# Altium schematic sheet Sheet1.SchDoc
size Letter
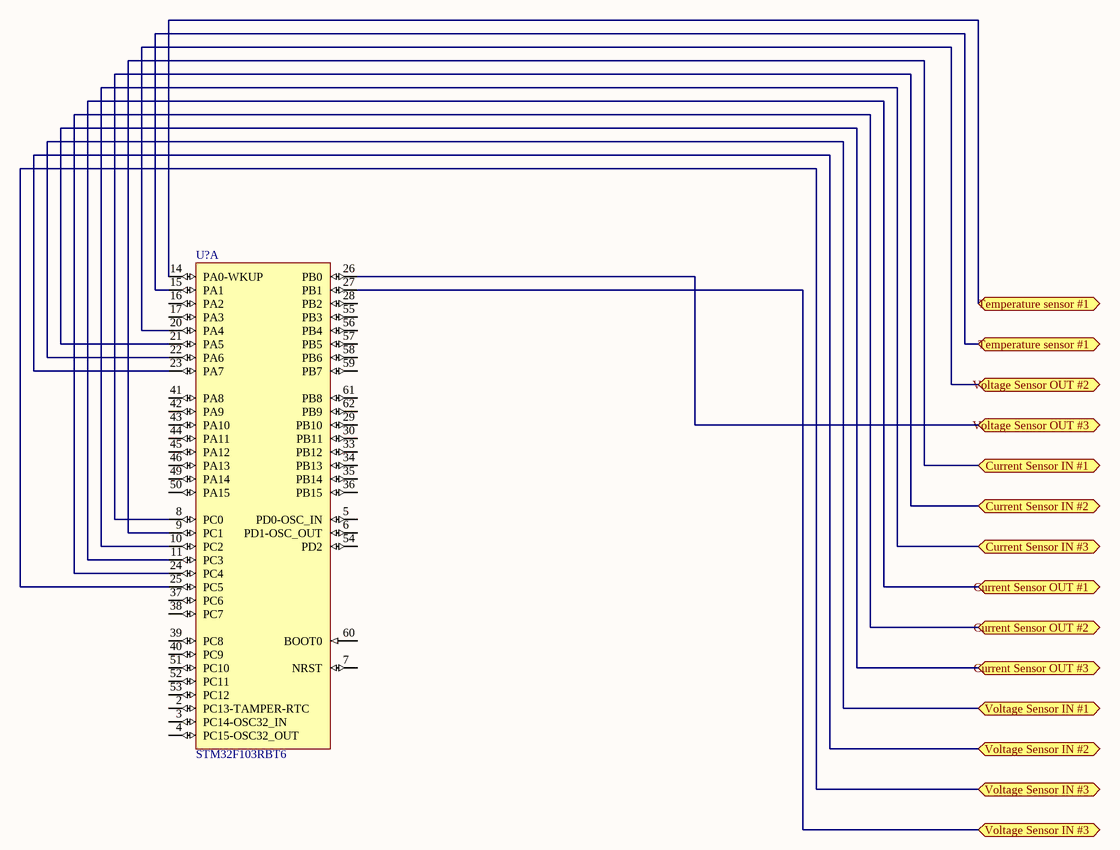
[diagram p0: Sheet1.SchDoc]

## Parts
U?  STM32F103RBT6  [STM-LQFP64_N]  (part A of 2)

## Ports
Current Sensor IN #1, Current Sensor IN #2, Current Sensor IN #3, Current Sensor OUT #1, Current Sensor OUT #2, Current Sensor OUT #3, Temperature sensor #1, Voltage Sensor IN #1, Voltage Sensor IN #2, Voltage Sensor IN #3, Voltage Sensor OUT #2, Voltage Sensor OUT #3

## Nets
Current Sensor IN #1: U?.9(PC1) ; port Current Sensor IN #1
Current Sensor IN #2: U?.8(PC0) ; port Current Sensor IN #2
Current Sensor IN #3: U?.10(PC2) ; port Current Sensor IN #3
Current Sensor OUT #1: U?.11(PC3) ; port Current Sensor OUT #1
Current Sensor OUT #2: U?.24(PC4) ; port Current Sensor OUT #2
Current Sensor OUT #3: U?.21(PA5) ; port Current Sensor OUT #3
Temperature sensor #1: U?.14(PA0-WKUP) U?.15(PA1) ; port Temperature sensor #1
Voltage Sensor IN #1: U?.22(PA6) ; port Voltage Sensor IN #1
Voltage Sensor IN #2: U?.23(PA7) ; port Voltage Sensor IN #2
Voltage Sensor IN #3: U?.25(PC5) U?.27(PB1) ; port Voltage Sensor IN #3
Voltage Sensor OUT #2: U?.20(PA4) ; port Voltage Sensor OUT #2
Voltage Sensor OUT #3: U?.26(PB0) ; port Voltage Sensor OUT #3

Not connected (* = marked no-connect by the designer): U? 2(PC13-TAMPER-RTC) 3(PC14-OSC32_IN) 4(PC15-OSC32_OUT) 5(PD0-OSC_IN) 6(PD1-OSC_OUT) 7(NRST) 16(PA2) 17(PA3) 28(PB2) 29(PB10) 30(PB11) 33(PB12) 34(PB13) 35(PB14) 36(PB15) 37(PC6) 38(PC7) 39(PC8) 40(PC9) 41(PA8) 42(PA9) 43(PA10) 44(PA11) 45(PA12) 46(PA13) 49(PA14) 50(PA15) 51(PC10) 52(PC11) 53(PC12) 54(PD2) 55(PB3) 56(PB4) 57(PB5) 58(PB6) 59(PB7) 60(BOOT0) 61(PB8) 62(PB9)

## Library data of the parts
U? = STM32F103RBT6: ARM Cortex-M3 32-bit MCU, 128 KB Flash, 20 KB Internal RAM, 51 I/Os, 64-pin LQFP, -40 to 85 degC, Tray; A/D Converter: 2x12-bit (16 Channel); FLASH Size (Prog) (kB): 128; I/Os (High Current): 51; Internal RAM Size (kB): 20; Operating Frequency(F) (Processor speed) (MHz): 72; Supply Voltage(Vcc) min (V): 2; DatasheetVersion: Rev. 16; PackageVersion: Rev. 4, 06/2013; PackageReference: LQFP64; PackageDescription: 64-Pin Low Profile Quad Flat Package, 10 x 10 mm Body, 0.5 mm Pitch; Supplier 1: Digi-Key; Supplier Part Number 1: 497-6066-ND; Supplier 2: Farnell; Supplier Part Number 2: 1447640; Supplier 3: Newark; Supplier Part Number 3: 59M2183; Supplier 4: Newark; Supplier Part Number 4: 57P1224; Supplier 5: Mouser; Supplier Part Number 5: 511-STM32F103RBT6; Core: ARM Cortex-M3; Packing: Tray; Mounting Technology: Surface Mount; PartNumber: STM32F103RBT6; ComponentLink1Description: Manufacturer URL; ComponentLink1URL: http://www.st.com/web/en/home.html; ComponentLink2Description: Datasheet; ComponentLink2URL: http://www.st.com/st-web-ui/static/active/en/resource/technical/document/datasheet/CD00161566.pdf; ComponentLink3Description: Package Specification; ComponentLink3URL: http://www.st.com/st-web-ui/static/active/en/resource/technical/document/datasheet/DM00037051.pdf